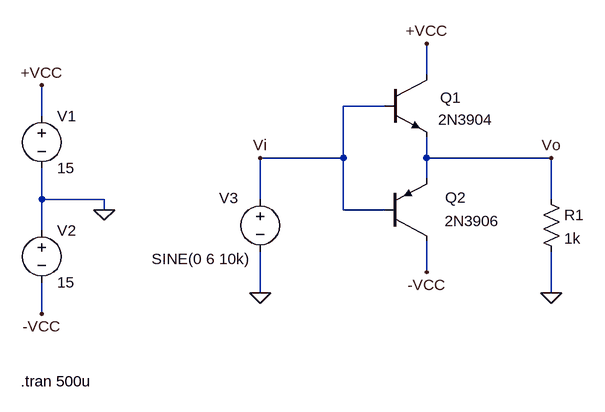
[diagram p0: schematic ClassB.asc]
ClassB.asc, the LTspice schematic file:
Version 4.1
SHEET 1 880 680
WIRE 208 128 208 80
WIRE 144 176 80 176
WIRE -384 192 -384 144
WIRE 80 256 80 176
WIRE 80 256 -48 256
WIRE 208 256 208 224
WIRE 400 256 208 256
WIRE 208 288 208 256
WIRE -384 320 -384 272
WIRE -288 320 -384 320
WIRE -48 320 -48 256
WIRE 400 320 400 256
WIRE -288 336 -288 320
WIRE 80 336 80 256
WIRE 144 336 80 336
WIRE -384 368 -384 320
WIRE 208 432 208 384
WIRE -48 464 -48 400
WIRE 400 464 400 400
WIRE -384 496 -384 448
FLAG 400 464 0
FLAG -288 336 0
FLAG -384 144 +VCC
FLAG -384 496 -VCC
FLAG 208 80 +VCC
FLAG 208 432 -VCC
FLAG -48 464 0
FLAG -48 256 Vi
FLAG 400 256 Vo
SYMBOL npn 144 128 R0
WINDOW 0 85 35 Left 2
WINDOW 3 82 69 Left 2
SYMATTR InstName Q1
SYMATTR Value 2N3904
SYMBOL pnp 144 384 M180
WINDOW 0 93 67 Left 2
WINDOW 3 92 31 Left 2
SYMATTR InstName Q2
SYMATTR Value 2N3906
SYMBOL res 384 304 R0
SYMATTR InstName R1
SYMATTR Value 1k
SYMBOL voltage -384 176 R0
WINDOW 123 0 0 Left 0
WINDOW 39 0 0 Left 0
SYMATTR InstName V1
SYMATTR Value 15
SYMBOL voltage -384 352 R0
WINDOW 123 0 0 Left 0
WINDOW 39 0 0 Left 0
SYMATTR InstName V2
SYMATTR Value 15
SYMBOL voltage -48 304 R0
WINDOW 0 -63 14 Left 2
WINDOW 3 -167 108 Left 2
WINDOW 123 0 0 Left 0
WINDOW 39 0 0 Left 0
SYMATTR InstName V3
SYMATTR Value SINE(0 6 10k)
TEXT -416 600 Left 2 !.tran 500u

The netlist it stands for:
* ClassB.asc
Q1 +VCC Vi Vo 0 2N3904
Q2 -VCC Vi Vo 0 2N3906
R1 Vo 0 1k
V1 +VCC 0 15
V2 0 -VCC 15
V3 Vi 0 SINE(0 6 10k)
.model NPN NPN
.model PNP PNP
.lib standard.bjt
.tran 500u
.backanno
.end